# EasyEDA Pro project ProProject_Air001_2024-07-03.epro

# Schematic Schematic1
Create Date: 2024-04-21; Page Name: P1; Project Name: Air001; Schematic Name: Schematic1; Update Date: 2024-05-07; Company: 嘉立创EDA; Page Size: A4; Version: V1.0
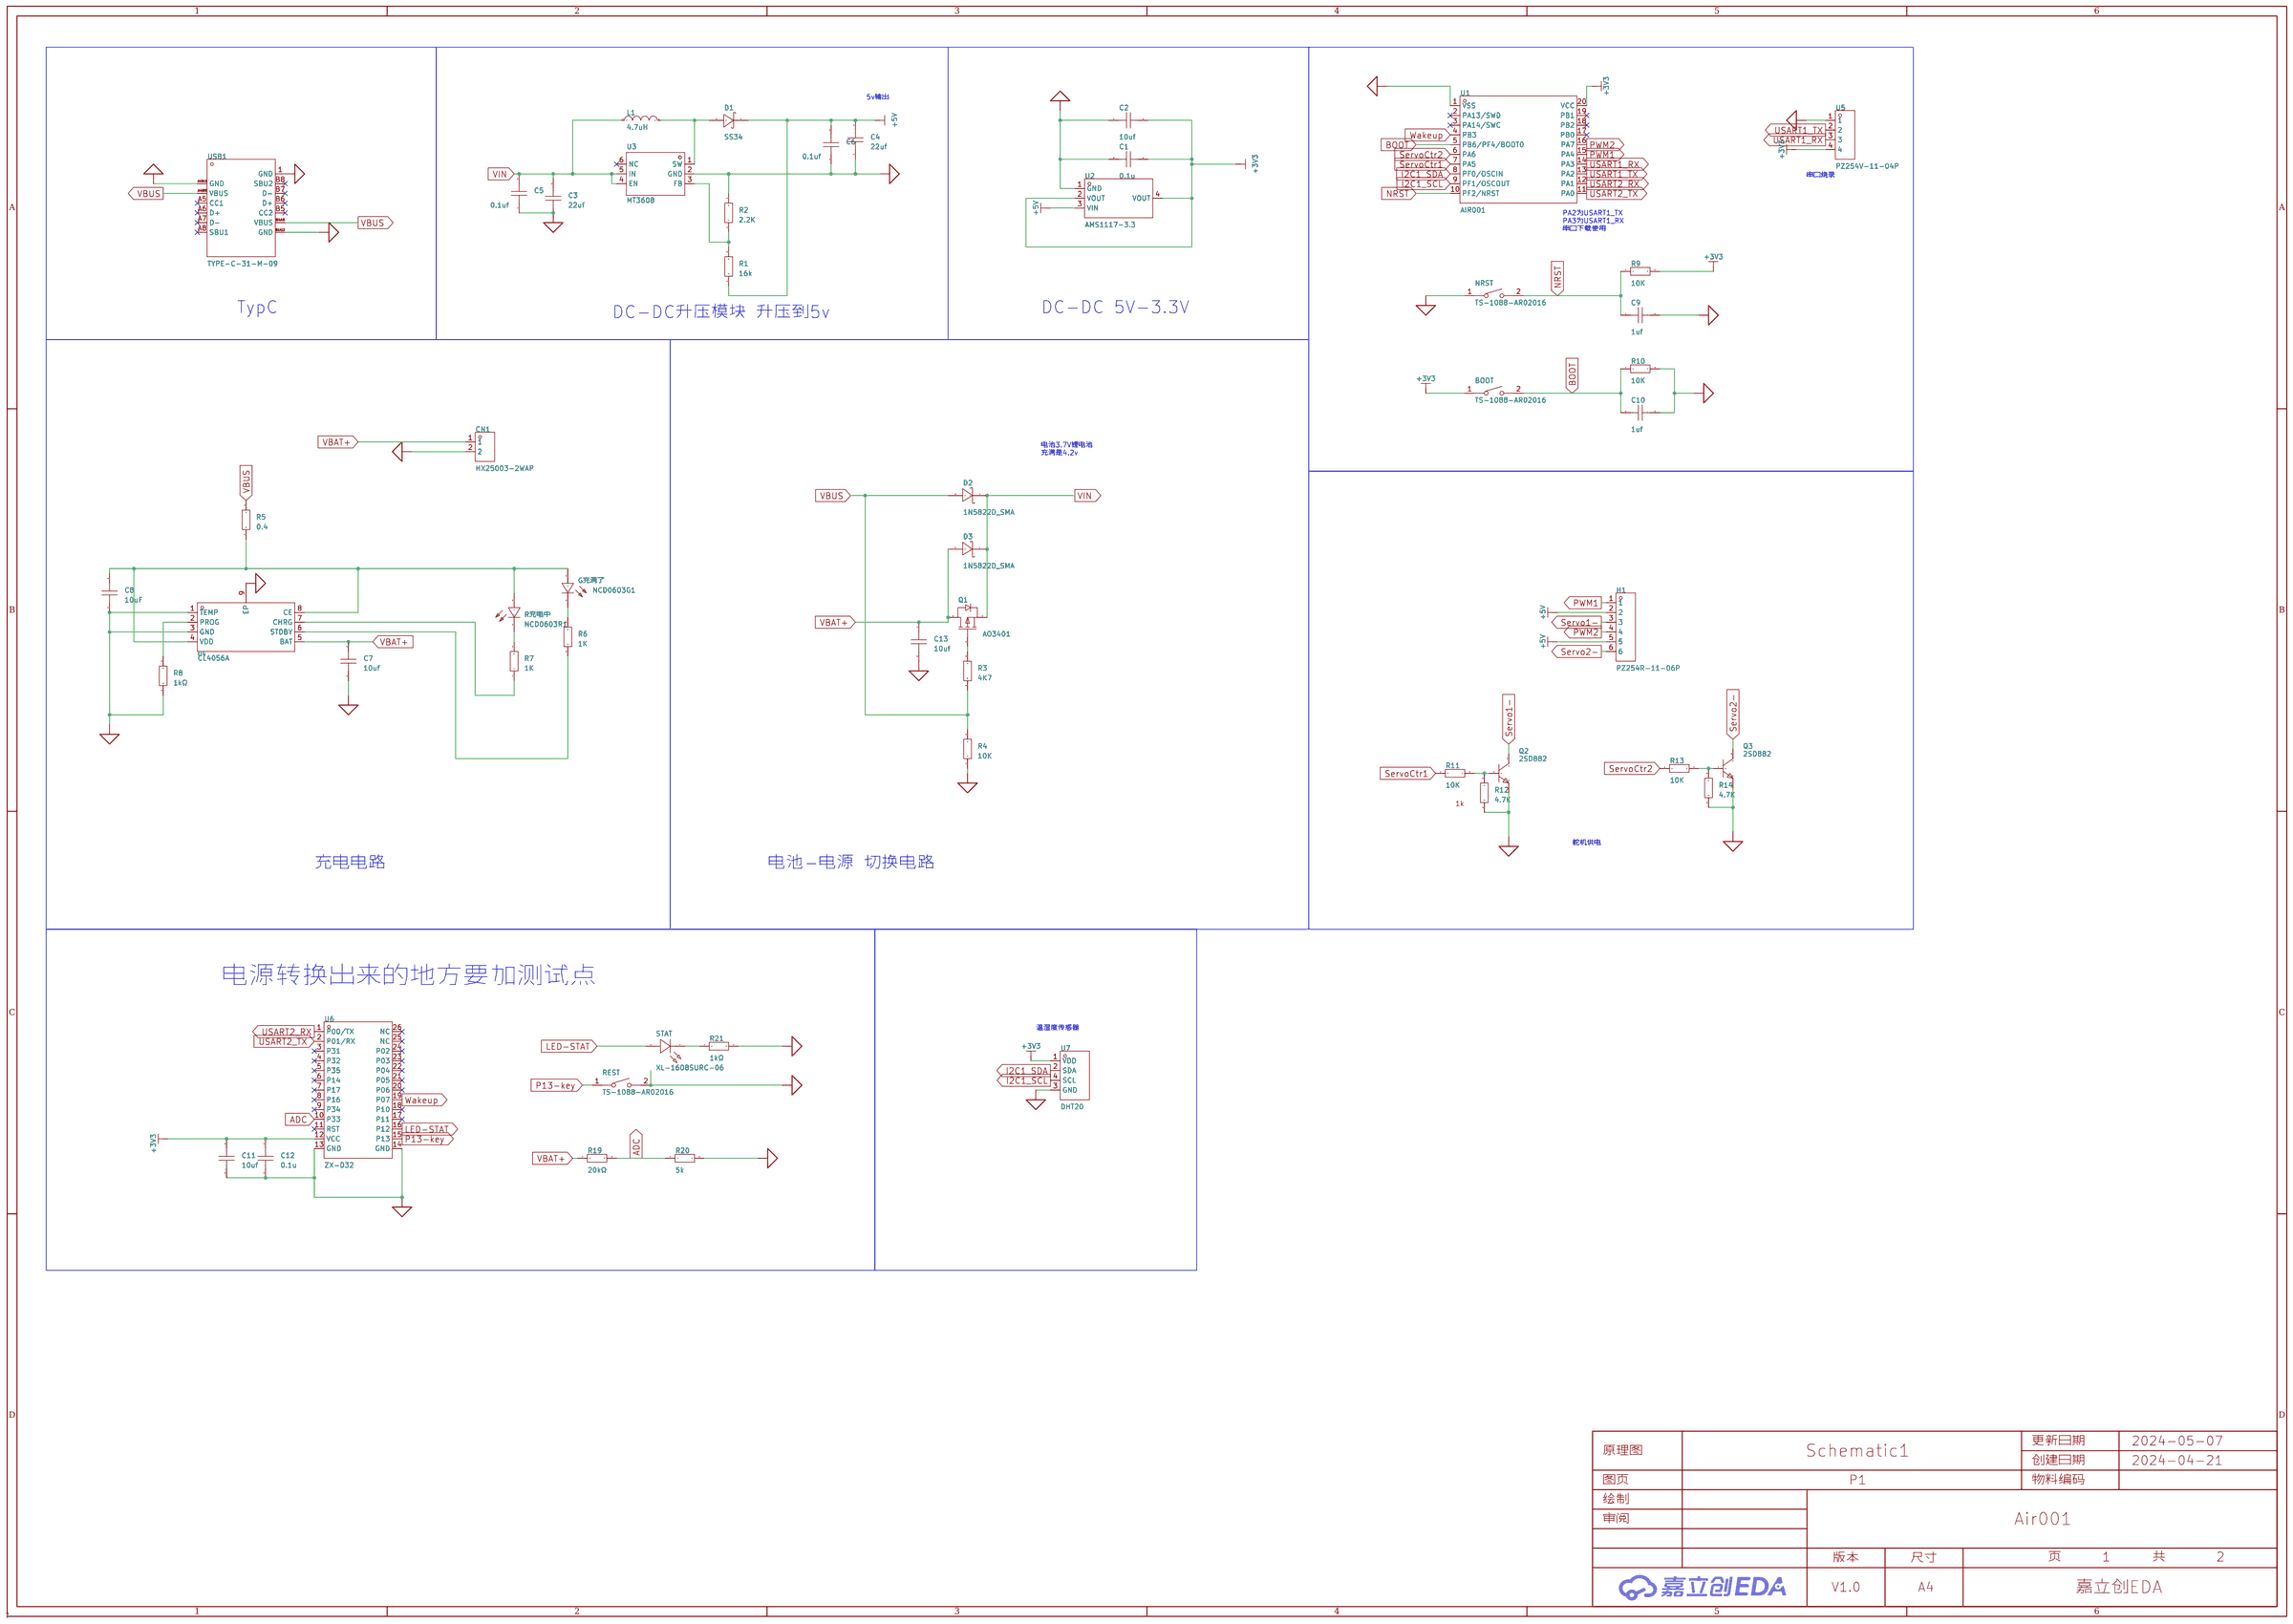
[diagram p0: schematic sheet]

## Parts
BOOT  TS-1088-AR02016  [SW-SMD_L3.9-W3.0-P4.45]
C1  0.1u  [C0603]
C2  10uf  [C0603]
C3  22uf  [C0603]
C4  22uf  [C0603]
C5  0.1uf  [C0603]
C6  0.1uf  [C0603]
C7  10uf  [C0603]
C8  10uF  [C0603]
C9  1uf  [C0603]
C10  1uf  [C0603]
C11  10uf  [C0603]
C12  0.1u  [C0603]
C13  10uf  [C0603]
CN1  HX25003-2WAP  [CONN-TH_2P-P2.50_HX25003-2WAP]
D1  SS34  [SMA_L4.3-W2.6-LS5.2-RD]
D2  1N5822D_SMA  [SMA_L4.3-W2.6-LS5.2-RD]
D3  1N5822D_SMA  [SMA_L4.3-W2.6-LS5.2-RD]
G充满了  NCD0603G1  [LED0603-RD]
H1  PZ254R-11-06P  [HDR-TH_6P-P2.54-H-M-W10.4]
L1  4.7uH  [IND-SMD_L11.5-W10.0_SMMS1040]
NRST  TS-1088-AR02016  [SW-SMD_L3.9-W3.0-P4.45]
Q1  AO3401  [SOT-23-3_L2.9-W1.6-P1.90-LS2.8-BR]
Q2  2SD882  [SOT-89-3_L4.5-W2.5-P1.50-LS4.1-BR]
Q3  2SD882  [SOT-89-3_L4.5-W2.5-P1.50-LS4.1-BR]
R1  16k  [C0805]
R2  2.2K  [R0805]
R3  4K7  [R0603]
R4  10K  [R0603]
R5  0.4  [R0603]
R6  1K  [R0603]
R7  1K  [R0603]
R8  1kΩ  [R0603]
R9  10K  [R0603]
R10  10K  [R0603]
R11  10K  [R0603]
R12  4.7K  [R0603]
R13  10K  [R0603]
R14  4.7K  [R0603]
R19  20kΩ  [R0603]
R20  5k  [R0603]
R21  1kΩ  [R0603]
REST  TS-1088-AR02016  [SW-SMD_L3.9-W3.0-P4.45]
R充电中  NCD0603R1  [LED0603-RD_RED]
STAT  XL-1608SURC-06  [LED0603-RD_RED]
U1  AIR001  [TSSOP-20_L6.5-W4.4-P0.65-LS6.4-BL]
U2  AMS1117-3.3  [SOT-223-3_L6.5-W3.4-P2.30-LS7.0-BR]
U3  MT3608  [SOT-23-6_L2.9-W1.6-P0.95-LS2.8-BL]
U4  CL4056A  [ESOP-8_L4.9-W3.9-P1.27-LS6.0-BL-EP]
U5  PZ254V-11-04P  [HDR-TH_4P-P2.54-V-M]
U6  ZX-D32  [WIFIM-SMD_26P-L26.7-W13.0-P1.50]
U7  DHT20  [SENSOR-TH_DHT20]
USB1  TYPE-C-31-M-09  [USB-C-SMD_TYPE-C-31-M-09]

## Library data of the parts
BOOT NRST REST = TS-1088-AR02016: 电路结构:单刀单掷;按钮形状:圆形按钮;作用力:160gf;安装方式:立贴;开关长度:4mm;开关宽度:3mm;开关高度:2mm;带支架:不带;触点电流:50mA;额定电压(DC):12V;绝缘电阻:100MΩ;机械寿命:10万次;; LCSC Part Name: 4*3*2mm 立贴 轻触开关; Supplier Part: C720477; Manufacturer: XUNPU(讯普); Supplier Footprint: SMD; JLCPCB Part Class: 扩展库; Datasheet: https://atta.szlcsc.com/upload/public/pdf/source/20200810/C720475_60D09DD6C54279ADDB2DC25100F1CC11.pdf; Supplier: LCSC; Circuit: 单刀单掷; Actuator Style: 圆形按钮; Operating Force: 160gf; Mounting Style: 立贴; Switch Length: 4mm; Switch Width: 3mm; Switch Height: 2mm; Strike Gundam: 不带; Contact Current: 50mA; Voltage Rating (DC): 12V; Insulation Resistance: 100MΩ; Actuator/Cap Color: 黑色; Pin Style: SMD接片; Mechanical Life: 10万次; Operating Temperature: -30℃~+80℃
C1-C7 C9-C13 = CAP_0603: Supplier Footprint: 0603
C8 = CL10A106MA8NRNC: 容值:10uF;精度:±20%;额定电压:25V;材质(温度系数):X5R;; LCSC Part Name: 10uF ±20% 25V; Supplier Part: C96446; Manufacturer: SAMSUNG(三星); Supplier Footprint: 0603; JLCPCB Part Class: Basic Part; Datasheet: https://atta.szlcsc.com/upload/public/pdf/source/20160218/1457707763339.pdf; Supplier: LCSC; Tolerance: ±20%; Voltage Rated: 25V; Temperature Coefficient: X5R
CN1 = HX25003-2WAP: 插针结构:1x2P;间距:2.5mm;安装方式:弯插;参考系列:XH;总PIN数:2P;排数:1;每排PIN数:2;行距:-;额定电流:-;工作温度范围:-;; LCSC Part Name: 1x2P 间距:2.5mm 弯插 系列:XH; Supplier Part: C442326; Manufacturer: HX(红星); Supplier Footprint: 弯插,P=2.5mm; JLCPCB Part Class: 扩展库; Datasheet: https://atta.szlcsc.com/upload/public/pdf/source/20191028/C442341_CB026E8ECE589085FA4A025D9CD8B44B.pdf; Supplier: LCSC; Pins Structure: 1x2P; Pitch: 2.5mm; Mounting Style: 弯插; Reference Series: XH; Number of Pins: 2P; Number of Rows: 1; Number of PINs Per Row: 2
D1 = SS34_C8678: 二极管配置:独立式;正向压降(Vf):550mV@3A;直流反向耐压(Vr):40V;平均整流电流(Io):3A;; LCSC Part Name: 电压:40V 电流:3A; Supplier Part: C8678; Manufacturer: MDD; Supplier Footprint: SMA(DO-214AC); JLCPCB Part Class: 基础库; Datasheet: https://atta.szlcsc.com/upload/public/pdf/source/20230314/A80AE34493C69B89E2F4B1712F433538.pdf; Supplier: LCSC; Diode Configuration: 独立式; Forward Voltage (Vf@If): 550mV@3A; Reverse Voltage (Vr): 40V; Average Rectified Current (Io): 3A; Reverse Leakage Current (Ir): 500uA@40V
D2 D3 = 1N5822D_SMA: 二极管配置:独立式;正向压降(Vf):550mV@3A;直流反向耐压(Vr):40V;平均整流电流(Io):3A;; Supplier Part: C9900001949; Manufacturer: MDD; Supplier Footprint: SMA_L4.3-W2.6-LS5.2; JLCPCB Part Class: Extended Part; Datasheet: https://atta.szlcsc.com/upload/public/pdf/source/20230314/A80AE34493C69B89E2F4B1712F433538.pdf; Supplier: LCSC; Diode Configuration: 独立式; Forward Voltage (Vf@If): 550mV@3A; Reverse Voltage (Vr): 40V; Average Rectified Current (Io): 3A; Reverse Leakage Current (Ir): 500uA@40V
G充满了 = NCD0603G1: 发光颜色:翠绿色;正向电压(VF):2.6V~3.6V;功率:72mW;正向电流:10mA;主波长:515nm~530nm;透镜颜色:无色透明透镜;发光强度:330mcd~900mcd;发光角度:130°;工作温度:-30℃~+85℃;; Supplier Part: C84267; Manufacturer: 国星光电; Supplier Footprint: 0603; JLCPCB Part Class: 扩展库; Datasheet: https://atta.szlcsc.com/upload/public/pdf/source/20200820/C84267_04BA7703640BAC111D09F5EFB971FBF3.pdf; Supplier: LCSC; Emitted Color: 翠绿色; Forward Voltage (VF): 2.6V~3.6V; Power Dissipation: 72mW; Forward Current: 10mA; Dominant Wavelength: 515nm~530nm; Lens Color: 无色透明透镜; Luminous Intensity: 330mcd~900mcd; Viewing Angle: 130°; Operating Temperature: -30℃~+85℃
H1 = PZ254R-11-06P: 插针结构:1x6P;间距:2.54mm;行距:-;圆针/方针:方针;安装类型:弯插;排数:单排;总PIN位数:6P;额定电流:-;额定电压:-;配合针长度:6mm;塑高:2.5mm;触头材质:黄铜;触头镀层:-;工作温度范围:-40℃~+105℃;颜色:黑色;; LCSC Part Name: 间距:2.54mm 1x6P 弯插 方针; Supplier Part: C492414; Manufacturer: XFCN(兴飞); Supplier Footprint: 弯插,P=2.54mm; JLCPCB Part Class: 扩展库; Datasheet: https://atta.szlcsc.com/upload/public/pdf/source/20200309/C492414_188252315A8FC19F8382BF484DD4F4B8.pdf; Supplier: LCSC; Pin Structure: 1x6P; Pitch: 2.54mm; Circluar Pins/Square Pins: 方针; Mounting Type: 弯插; Number of Rows: 单排; Number of Pins: 6P; Length of Mating Pin: 6mm; Insulation Height: 2.5mm; Contact Material: 黄铜; Operating Temperature Range: -40℃~+105℃; Color: 黑色
L1 = YSPI1050-4R7M: 电感值:4.7uH;精度:±20%;额定电流:8A;; LCSC Part Name: 4.7uH ±20%; Supplier Part: C497895; Manufacturer: YJYCOIN(益嘉源); Supplier Footprint: SMD,10x10.1mm; JLCPCB Part Class: Extended Part; Datasheet: https://atta.szlcsc.com/upload/public/pdf/source/20200317/C497892_513B7AAEAA9324EEBE20C95E8E203C0E.pdf; Supplier: LCSC; Tolerance: ±20%; Rated Current: 8A; DC Resistance (DCR): 13.8mΩ
Q1 = AO3401_C688915: 类型:1个P沟道;漏源电压(Vdss):30V;连续漏极电流(Id):4.2A;功率(Pd):1.2W;导通电阻(RDS(on)@Vgs,Id):50mΩ@10V,4.2A;阈值电压(Vgs(th)@Id):1V@250uA;; LCSC Part Name: 1个P沟道 耐压:30V 电流:4.2A; Supplier Part: C688915; Manufacturer: LGE(鲁光); Supplier Footprint: SOT-23; JLCPCB Part Class: 扩展库; Datasheet: https://atta.szlcsc.com/upload/public/pdf/source/20200622/C688915_14CA049379670312E9F9920C23D236FF.pdf; Supplier: LCSC; Type: 1个P沟道; Drain Source Voltage (Vdss): 30V; Continuous Drain Current (Id): 4.2A; Power Dissipation (Pd): 1.2W; Drain Source On Resistance (RDS(on)@Vgs,Id): 50mΩ@10V,4.2A; Gate Threshold Voltage (Vgs(th)@Id): 1V@250uA; Total Gate Charge (Qg@Vgs): 9.5nC@4.5V; Input Capacitance (Ciss@Vds): 950pF@15V; Reverse Transfer Capacitance (Crss@Vds): 75pF@15V
Q2 Q3 = 2SD882_C842818: 晶体管类型:NPN;集电极电流(Ic):3A;集射极击穿电压(Vceo):30V;功率(Pd):500mW;; LCSC Part Name: 耐压:30V 电流:3A NPN; Supplier Part: C842818; Manufacturer: FUXINSEMI(富芯森美); Supplier Footprint: SOT-89-3; JLCPCB Part Class: 扩展库; Datasheet: https://atta.szlcsc.com/upload/public/pdf/source/20200930/C842818_75E6D807A97B150B9507AB7B86B43F2A.pdf; Supplier: LCSC; Transistor Type: NPN; Collector Current (Ic): 3A; Collector-Emitter Breakdown Voltage (Vceo): 30V; Power Dissipation (Pd): 500mW; Transition Frequency (fT): 50MHz; Collector Cut-Off Current (Icbo): 1uA; Collector-Emitter Saturation Voltage (VCE(sat)@Ic,Ib): 500mV@2A,200mA; Operating Temperature: -55℃~+150℃@(Tj)
R1-R7 R9-R14 = Res_0603: Supplier Footprint: 0603
R8 R21 = RC0603FR-071KL: 电阻类型:厚膜电阻;阻值:1kΩ;精度:±1%;功率:100mW;最大工作电压:75V;温度系数:±100ppm/℃;; LCSC Part Name: 厚膜电阻 1kΩ ±1% 100mW; Supplier Part: C22548; Manufacturer: YAGEO(国巨); Supplier Footprint: 0603; JLCPCB Part Class: Extended Part; Datasheet: https://atta.szlcsc.com/upload/public/pdf/source/20180316/70C0E2BDAE7FCC62C531A5A58D202EE1.pdf; Supplier: LCSC; Type: 厚膜电阻; Tolerance: ±1%; Power(Watts): 100mW; Overload Voltage (Max): 75V; Temperature Coefficient: ±100ppm/℃; Operating Temperature Range: -55℃~+155℃
R19 = 0603WAF1002T5E: 电阻类型:厚膜电阻;阻值:10kΩ;精度:±1%;功率:100mW;最大工作电压:75V;温度系数:±100ppm/℃;; LCSC Part Name: 厚膜电阻 10kΩ ±1% 100mW; Supplier Part: C25804; Manufacturer: UNI-ROYAL(厚声); Supplier Footprint: 0603; JLCPCB Part Class: Basic Part; Datasheet: https://atta.szlcsc.com/upload/public/pdf/source/20200306/C422600_1E6D84923E4A46A82E41ADD87F860B5C.pdf; Supplier: LCSC; Type: 厚膜电阻; Tolerance: ±1%; Power(Watts): 100mW; Overload Voltage (Max): 75V; Temperature Coefficient: ±100ppm/℃; Operating Temperature Range: -55℃~+155℃
R20 = 0603WAF2701T5E: 电阻类型:厚膜电阻;阻值:2.7kΩ;精度:±1%;功率:100mW;最大工作电压:75V;温度系数:±100ppm/℃;; LCSC Part Name: 2.7kΩ ±1% 100mW 厚膜电阻; Supplier Part: C13167; Manufacturer: UNI-ROYAL(厚声); Supplier Footprint: 0603; JLCPCB Part Class: Basic Part; Datasheet: https://atta.szlcsc.com/upload/public/pdf/source/20200306/C422600_1E6D84923E4A46A82E41ADD87F860B5C.pdf; Supplier: LCSC; Type: 厚膜电阻; Tolerance: ±1%; Power(Watts): 100mW; Overload Voltage (Max): 75V; Temperature Coefficient: ±100ppm/℃; Operating Temperature Range: -55℃~+155℃
R充电中 = NCD0603R1_C84263: 灯头类型:-;发光颜色:红色;正向电压(VF):1.6V~2.6V;功率:65mW;正向电流:20mA;主波长:615nm~630nm;二极管配置:独立二极管;透镜颜色:无色透明透镜;色温:-;发光强度:80mcd~220mcd;发光角度:130°;载带方式:-;工作温度:-30℃~+85℃;; Supplier Part: C84263; Manufacturer: 国星光电; Supplier Footprint: 0603; JLCPCB Part Class: 扩展库; Datasheet: https://atta.szlcsc.com/upload/public/pdf/source/20200820/C84263_DABC6A75E58F576973B407FDBA283D60.pdf; Supplier: LCSC; Emitted Color: 红色; Forward Voltage (VF): 1.6V~2.6V; Power Dissipation: 65mW; Forward Current: 20mA; Dominant Wavelength: 615nm~630nm; Diode Configuration: 独立二极管; Lens Color: 无色透明透镜; Luminous Intensity: 80mcd~220mcd; Viewing Angle: 130°; Operating Temperature: -30℃~+85℃
STAT = XL-1608SURC-06: 发光颜色:红色;功率:55mW;正向电流:25mA;主波长:617nm~621nm;透镜颜色:无色透明透镜;色温:-;发光角度:120°;载带方式:正贴;工作温度:-30℃~+85℃;; Supplier Part: C965799; Manufacturer: XINGLIGHT(成兴光); Supplier Footprint: 0603; JLCPCB Part Class: 扩展库; Datasheet: https://atta.szlcsc.com/upload/public/pdf/source/20221102/D860AFDD1CDB02C5A8064103A32707E2.pdf; Supplier: LCSC; Emitted Color: 红色; Power Dissipation: 55mW; Forward Current: 25mA; Dominant Wavelength: 617nm~621nm; Peak Wavelength: 623nm; Lens Color: 无色透明透镜; Viewing Angle: 120°; Mounting Sytle: 正贴; Operating Temperature: -30℃~+85℃
U1 = AIR001: Supplier Part: C7461672; Supplier Footprint: TSSOP-20; JLCPCB Part Class: 扩展库; Supplier: LCSC
U2 = AMS1117-3.3_C6186: 输出类型:固定;最大输入电压:-;输出电压:3.3V;最大输出电流:1A;电源纹波抑制比(PSRR):72dB@(120Hz);输出极性:正极;; LCSC Part Name: 输出3.3V 1A; Supplier Part: C6186; Manufacturer: AMS; Supplier Footprint: SOT-223-3; JLCPCB Part Class: 基础库; Datasheet: https://atta.szlcsc.com/upload/public/pdf/source/20180727/C6186_7A095716F0823C02F1997A905E26C086.pdf; Supplier: LCSC; Output Type: 固定; Output Voltage: 3.3V; MAX Output Current: 1A; Power Supply Rejection Ratio (PSRR): 72dB@(120Hz); Dropout Voltage: 1.3V@(800mA); Output Polarity: 正极; Number of Outputs: 1
U3 = MT3608: 功能类型:升压型;输入电压:2V~24V;输出电压:28V;输出电流(最大值):-;; Supplier Part: C84817; Manufacturer: 西安航天民芯; Supplier Footprint: SOT-23-6; JLCPCB Part Class: 扩展库; Datasheet: https://atta.szlcsc.com/upload/public/pdf/source/20161110/1478743351706.pdf; Supplier: LCSC; Function: 升压型; Input Voltage: 2V~24V; Output Voltage: 28V; Switching Frequency: 1.2MHz; Number of Outputs: 1; Topology: 升压式; Switch tube (built-in/external): 内置
U4 = CL4056A: Supplier Part: C181916; Manufacturer: CHIPLINK(芯联); Supplier Footprint: ESOP-8; JLCPCB Part Class: 扩展库; Datasheet: https://atta.szlcsc.com/upload/public/pdf/source/20180301/C181916_15198944900991384040.pdf; Supplier: LCSC
U5 = PZ254V-11-04P: 插针结构:1x4P;间距:2.54mm;行距:-;圆针/方针:方针;安装类型:直插;排数:单排;总PIN位数:4P;额定电流:3A;额定电压:250V;配合针长度:6mm;塑高:2.5mm;端接针长度:3mm;触头材质:-;工作温度范围:-40℃~+105℃;颜色:黑色;; LCSC Part Name: 间距:2.54mm 1x4P 直插 方针; Supplier Part: C2691448; Manufacturer: XFCN(兴飞); Supplier Footprint: 插件,P=2.54mm; JLCPCB Part Class: Extended Part; Datasheet: https://atta.szlcsc.com/upload/public/pdf/source/20200309/C492403_F9F19131791D08044AD4F84F8E751A34.pdf; Supplier: LCSC; Pin Structure: 1x4P; Pitch: 2.54mm; Circluar Pins/Square Pins: 方针; Mounting Type: 直插; Number of Rows: 单排; Number of Pins: 4P; Current Rating (Max): 3A; Voltage Rating (Max): 250V; Length of Mating Pin: 6mm; Insulation Height: 2.5mm; Length of End Connection Pin: 3mm; Operating Temperature Range: -40℃~+105℃; Color: 黑色
U6 = ZX-D32_1: Supplier Part: F; Supplier Footprint: QFN; JLCPCB Part Class: 扩展库; Supplier: LCSC
U7 = DHT20: LCSC Part Name: 温湿度传感器模块; Supplier Part: C3012627; Manufacturer: 广州奥松; Supplier Footprint: SIP-4; JLCPCB Part Class: 扩展库; Datasheet: https://atta.szlcsc.com/upload/public/pdf/source/20220512/BB794F5DBF3D5EF255732E5D5E8CA7C2.pdf; Supplier: LCSC
USB1 = TYPE-C-31-M-09: 连接器类型:Type-C;标准:-;公母:母;端口数量:1;触点数量:16P;安装方式:卧贴;额定电流 - 电源:-;工作温度范围:-40℃~+80℃;; LCSC Part Name: Type-C 母 卧贴; Supplier Part: C2689967; Manufacturer: 韩国韩荣; Supplier Footprint: SMD; JLCPCB Part Class: 扩展库; Datasheet: https://atta.szlcsc.com/upload/public/pdf/source/20210810/4FB1FF27D732B53405BB8B0F3A718A10.pdf; Supplier: LCSC; Connector Type: Type-C; Gender: 母; Number of Ports: 1; Number of Contacts: 16P; Mounting Style: 卧贴; Operating Temperature Range: -40℃~+80℃

## Nets
+3V3: BOOT.1 C1.1 C2.2 C11.2 C12.1 R9.2 U1.20(VCC) U2.2(VOUT) U2.4(VOUT) U5.4 U6.12(VCC) U7.1(VDD)
+5V: C4.2 C6.2 D1.1(K) H1.2 H1.5 R1.1 U2.3(VIN)
AGND: C1.2 C2.1 C3.1 C4.1 C5.1 C6.1 C7.2 C8.1 C9.2 C10.2 C11.1 C12.2 C13.2 CN1.2 NRST.1 Q2.3(E) Q3.3(E) R2.2 R4.1 R8.1 R10.2 R12.1 R14.1 R20.2 R21.2 REST.2 U1.1(VSS) U2.1(GND) U3.2(GND) U4.1(TEMP) U4.3(GND) U4.9(EP) U5.1 U6.13(GND) U6.14(GND) U7.3(GND) USB1.1(GND) USB1.A1B12(GND) USB1.B1A12(GND)
VBAT+: C7.1 C13.1 CN1.1 D3.2(A) Q1.3(D) R19.1 U4.5(BAT)
VBUS: D2.2(A) R3.1 R4.2 R5.2 USB1.A4B9(VBUS) USB1.B4A9(VBUS)
VIN: C3.2 C5.2 D2.1(K) D3.1(K) L1.1 Q1.2(S) U3.4(EN) U3.5(IN)
ADC: R19.2 R20.1 U6.10(P33)
BOOT: BOOT.2 C10.1 R10.1 U1.5(PB6/PF4/BOOT0)
I2C1_SCL: U1.9(PF1/OSCOUT) U7.4(SCL)
I2C1_SDA: U1.8(PF0/OSCIN) U7.2(SDA)
LED-STAT: STAT.2(A) U6.16(P12)
NRST: C9.1 NRST.2 R9.1 U1.10(PF2/NRST)
P13-key: REST.1 U6.15(P13)
PWM1: H1.1 U1.15(PA4)
PWM2: H1.4 U1.16(PA7)
Servo1-: H1.3 Q2.2(C)
Servo2-: H1.6 Q3.2(C)
ServoCtr1: R11.1 U1.7(PA5)
ServoCtr2: R13.1 U1.6(PA6)
USART1_RX: U1.14(PA3) U5.3
USART1_TX: U1.13(PA2) U5.2
USART2_RX: U1.12(PA1) U6.1(P00/TX)
USART2_TX: U1.11(PA0) U6.2(P01/RX)
Wakeup: U1.4(PB3) U6.19(P07)
$1N1635: D1.2(A) L1.2 U3.1(SW)
$1N1808: R1.2 R2.1 U3.3(FB)
$1N2553: Q1.1(G) R3.2
$1N3521: G充满了.1(K) R6.2
$1N3547: R7.2 R充电中.1(K)
$1N3574: R6.1 U4.6(STDBY)
$1N3588: R7.1 U4.7(CHRG)
$1N3600: C8.2 G充满了.2(A) R5.1 R充电中.2(A) U4.4(VDD) U4.8(CE)
$1N3631: R8.2 U4.2(PROG)
$1N5712: Q2.1(B) R11.2 R12.2
$1N5900: Q3.1(B) R13.2 R14.2
$1N6798: R21.1 STAT.1(K)

Not connected (* = marked no-connect by the designer): U1 2(PA13/SWD)* 3(PA14/SWC)* 17(PB0)* 18(PB2)* 19(PB1)*; U3 6(NC)*; U6 3(P31)* 4(P32)* 5(P35)* 6(P14)* 7(P17)* 8(P16)* 9(P34)* 11(RST)* 17(P11)* 18(P10)* 20(P06)* 21(P05)* 22(P04)* 23(P03)* 24(P02)* 25(NC)* 26(NC)*; USB1 A5(CC1)* A6(D+)* A7(D-)* A8(SBU1)* B5(CC2)* B6(D+)* B7(D-)* B8(SBU2)*

## Notes on the sheet
- 5v输出
- 串口烧录
- PA2为USART1_TX
  PA3为USART1_RX
  串口下载使用
- TypC
- DC-DC 5V-3.3V
- DC-DC升压模块 升压到5v
- 电池3.7V锂电池
  充满是4.2v
- 1k
- 舵机供电
- 充电电路
- 电池-电源 切换电路
- 电源转换出来的地方要加测试点
- 温湿度传感器

# Board PCB1
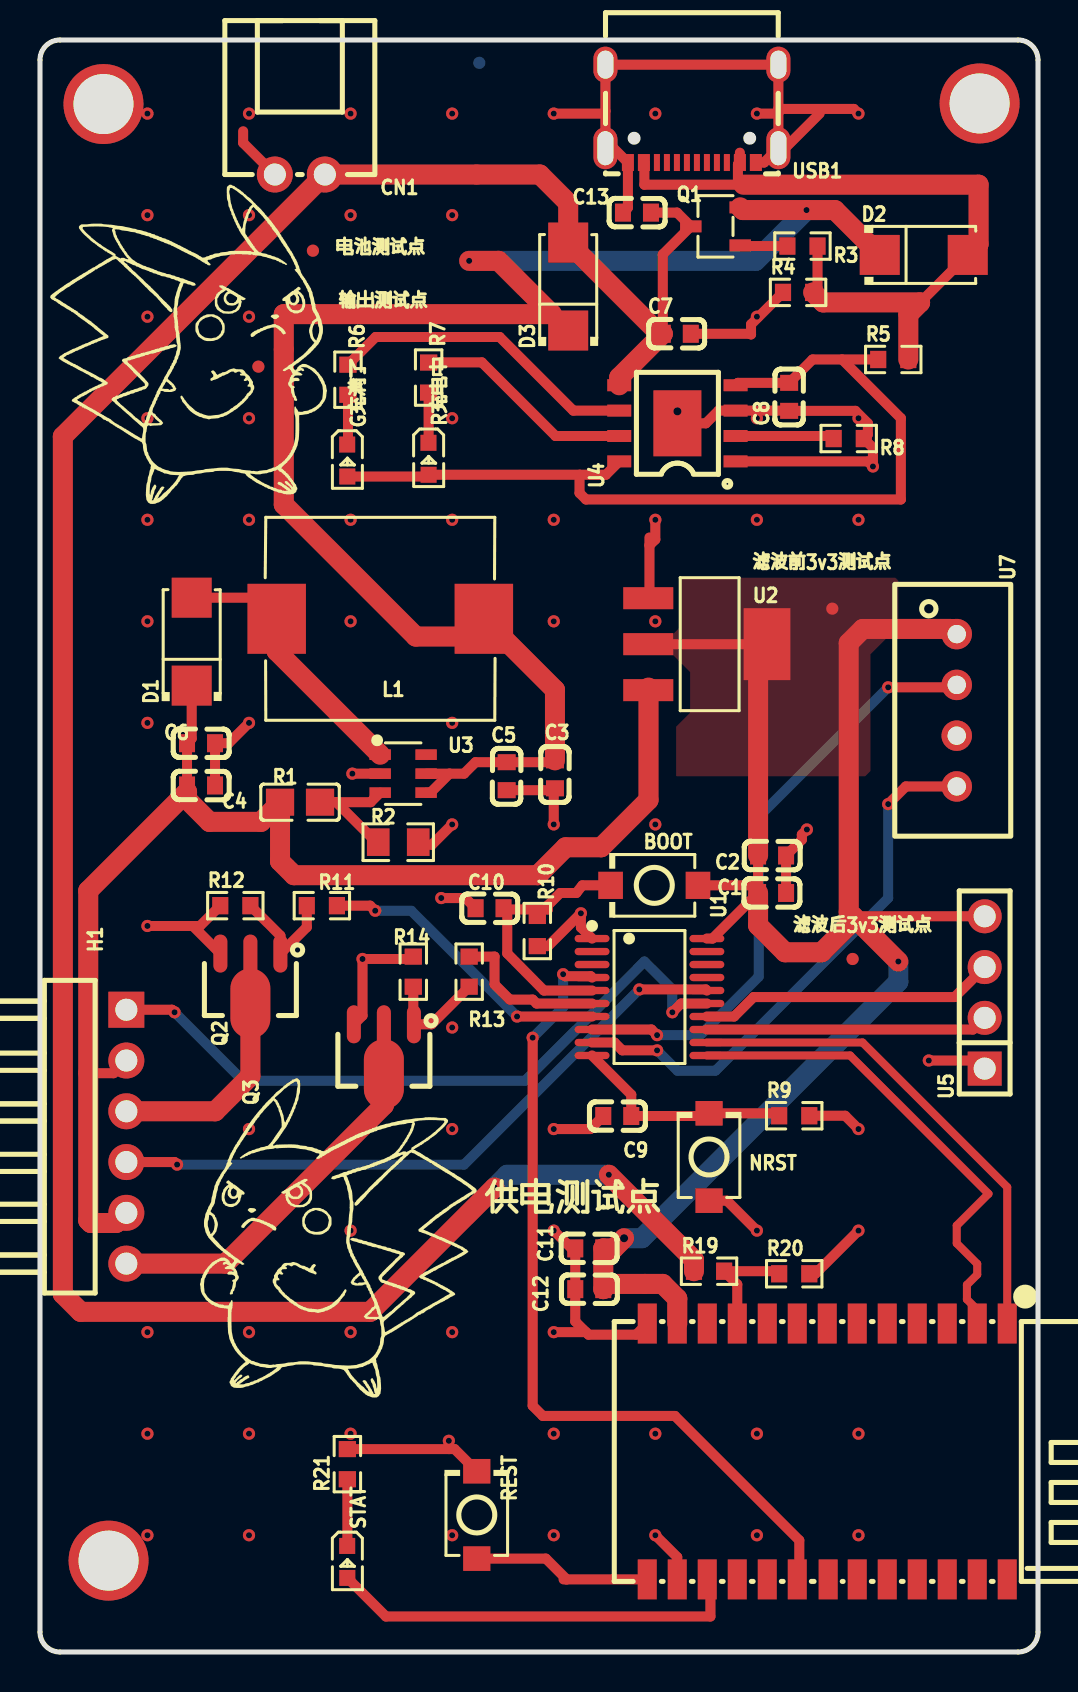
[diagram p1: board, top side]
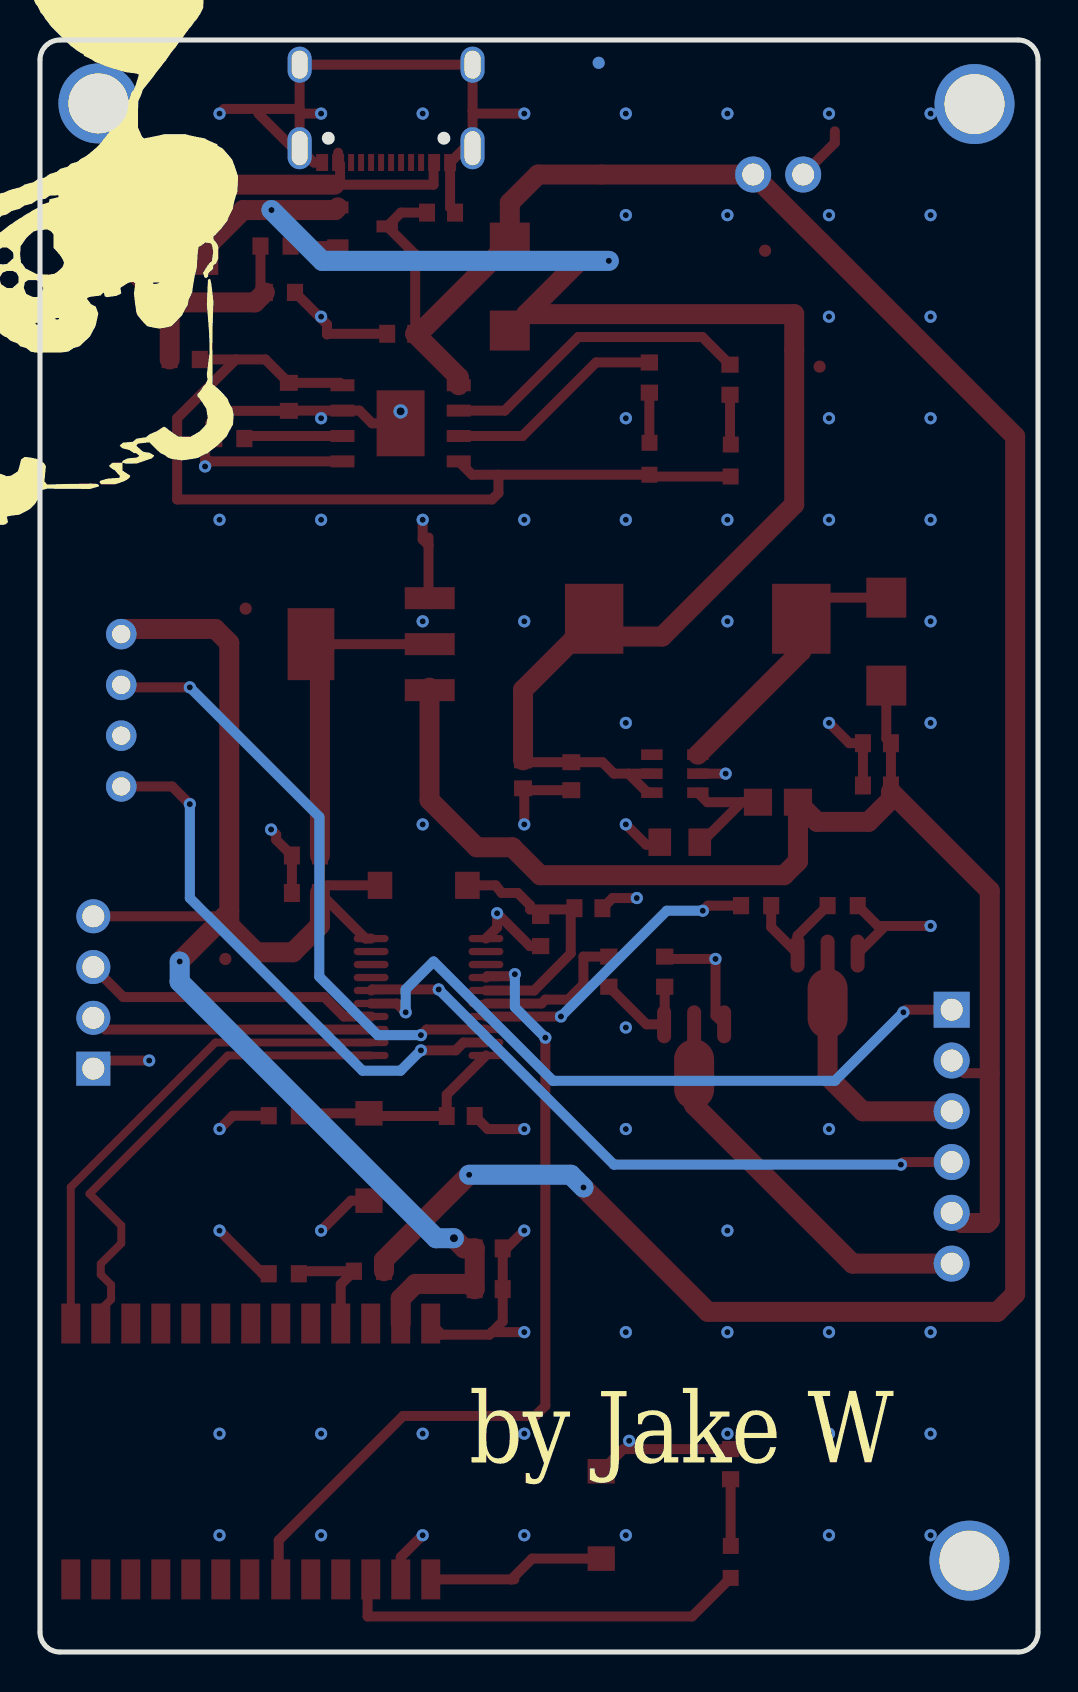
[diagram p2: board, bottom side, seen from below]

Outline 49.91 x 80.65 mm; copper layers: Top Layer, Bottom Layer. Coordinates in mm from the lower left corner of the outline.
Outline path: 0,79.65 0,1 arc(0.29,0.29) 1,0 48.91,0 arc(49.62,0.29) 49.91,1 49.91,79.65 arc(49.62,80.35) 48.91,80.65 1,80.65 arc(0.29,80.35) 0,79.65
Stack: Top Layer 0.035mm / Dielectric1 1.51mm FR4 er 4.5 / Bottom Layer 0.035mm

## Design rules (mm)
net USART2_RX: DP1
net USART2_TX: DP1
template: JLCPCB Capability(Two Layers Board)
spacing copperThickness1oz (default): track to track 0.102, other pairs 0.152 to 0.3
spacing copperThickness2oz: track to track 0.203, other pairs 0.152 to 0.3
track width copperThickness1oz (default): min 0.127, default 0.254, max 2.54
track width copperThickness2oz: min 0.203, default 0.254, max 2.54
differential pair differentialPair (default): width min 0.127, default 0.254, max 2.54; gap min 0.152, default 0.152
via viaSize (default): diameter min 0.5, default 0.61, max 10; hole min 0.3, default 0.305, max 6.3

## Placement (name value [footprint] x y rotation side)
BOOT  TS-1088-AR02016  [SW-SMD_L3.9-W3.0-P4.45]  30.72 38.35 180 top
C1  0.1u  [C0603]  36.61 37.97 0 top
C2  10uf  [C0603]  36.61 39.85 180 top
C3  22uf  [C0603]  25.75 43.91 90 top
C4  22uf  [C0603]  8.05 43.35 180 top
C5  0.1uf  [C0603]  23.34 43.82 90 top
C6  0.1uf  [C0603]  8.05 45.47 180 top
C7  10uf  [C0603]  31.85 65.95 0 top
C8  10uF  [C0603]  37.46 62.79 90 top
C9  1uf  [C0603]  28.87 26.81 180 top
C10  1uf  [C0603]  22.48 37.21 180 top
C11  10uf  [C0603]  27.47 20.19 0 top
C12  0.1u  [C0603]  27.47 18.15 180 top
C13  10uf  [C0603]  29.85 72.01 180 top
CN1  HX25003-2WAP  [CONN-TH_2P-P2.50_HX25003-2WAP]  12.99 73.91 180 top
D1  SS34  [SMA_L4.3-W2.6-LS5.2-RD]  7.59 50.55 90 top
D2  1N5822D_SMA  [SMA_L4.3-W2.6-LS5.2-RD]  44.2 69.89 0 top
D3  1N5822D_SMA  [SMA_L4.3-W2.6-LS5.2-RD]  26.42 68.31 90 top
G充满了  NCD0603G1  [LED0603-RD]  15.37 59.61 270 top
H1  PZ254R-11-06P  [HDR-TH_6P-P2.54-H-M-W10.4]  4.32 25.78 270 top
L1  4.7uH  [IND-SMD_L11.5-W10.0_SMMS1040]  17.02 51.69 180 top
NOREF  -  [Pad_e2450]  3.17 77.44 0 top
NOREF#2  -  [Pad_e2380]  10.92 64.3 0 top
NOREF#3  -  [Pad_e2453]  46.99 77.47 0 top
NOREF#4  -  [Pad_e2384]  39.62 52.2 0 top
NOREF#5  -  [Pad_e2454]  3.43 4.57 0 top
NOREF#6  -  [Pad_e2445]  21.97 79.5 0 top
NOREF#7  -  [Pad_e2442]  40.64 34.67 0 top
NOREF#8  -  [Pad_e2397]  13.65 70.1 0 top
NOREF#9  -  [Pad_e2429]  30.25 18.42 0 top
NRST  TS-1088-AR02016  [SW-SMD_L3.9-W3.0-P4.45]  33.46 24.77 90 top
Q1  AO3401  [SOT-23-3_L2.9-W1.6-P1.90-LS2.8-BR]  33.78 71.32 0 top
Q2  2SD882  [SOT-89-3_L4.5-W2.5-P1.50-LS4.1-BR]  10.52 33.69 90 top
Q3  2SD882  [SOT-89-3_L4.5-W2.5-P1.50-LS4.1-BR]  17.2 30.15 90 top
R1  16k  [C0805]  13 42.51 0 top
R2  2.2K  [R0805]  17.92 40.51 0 top
R3  4K7  [R0603]  38.13 70.33 180 top
R4  10K  [R0603]  37.91 68.02 0 top
R5  0.4  [R0603]  42.67 64.66 0 top
R6  1K  [R0603]  15.4 63.65 270 top
R7  1K  [R0603]  19.44 63.76 270 top
R8  1kΩ  [R0603]  40.44 60.71 180 top
R9  10K  [R0603]  37.72 26.83 0 top
R10  10K  [R0603]  24.87 36.07 270 top
R11  10K  [R0603]  14.1 37.34 180 top
R12  4.7K  [R0603]  9.77 37.34 0 top
R13  10K  [R0603]  21.46 34.04 270 top
R14  4.7K  [R0603]  18.67 34.04 270 top
R19  20kΩ  [R0603]  33.46 19.05 0 top
R20  5k  [R0603]  37.72 18.92 0 top
R21  1kΩ  [R0603]  15.37 9.4 90 top
REST  TS-1088-AR02016  [SW-SMD_L3.9-W3.0-P4.45]  21.84 6.86 90 top
R充电中  NCD0603R1  [LED0603-RD_RED]  19.43 59.69 270 top
STAT  XL-1608SURC-06  [LED0603-RD_RED]  15.37 4.51 270 top
U1  AIR001  [TSSOP-20_L6.5-W4.4-P0.65-LS6.4-BL]  30.48 32.77 270 top
U2  AMS1117-3.3  [SOT-223-3_L6.5-W3.4-P2.30-LS7.0-BR]  33.39 50.42 180 top
U3  MT3608  [SOT-23-6_L2.9-W1.6-P0.95-LS2.8-BL]  18.16 43.94 270 top
U4  CL4056A  [ESOP-8_L4.9-W3.9-P1.27-LS6.0-BL-EP]  31.88 61.47 90 top
U5  PZ254V-11-04P  [HDR-TH_4P-P2.54-V-M]  47.24 33 90 top
U6  ZX-D32  [WIFIM-SMD_26P-L26.7-W13.0-P1.50]  39.37 10.03 270 top
U7  DHT20  [SENSOR-TH_DHT20]  45.85 47.11 270 top
USB1  TYPE-C-31-M-09  [USB-C-SMD_TYPE-C-31-M-09]  32.6 76.96 180 top

## Footprints (pads in the part's own frame, mm; a bottom-side part is the same pattern mirrored in y, then rotated)
C0603
  rect 0.8x0.9 smd: 1(-0.7,0) 2(0.7,0)
C0805
  rect 1.41x1.35 smd: 1(-1,0) 2(1,0)
CONN-TH_2P-P2.50_HX25003-2WAP
  round 1.8 hole 1.1: 1(-1.25,0) 2(1.25,0)
ESOP-8_L4.9-W3.9-P1.27-LS6.0-BL-EP
  rect 0.6x1.2 smd: 1(-1.905,-2.909) 2(-0.635,-2.909) 3(0.635,-2.909) 4(1.905,-2.909) 5(1.905,2.909) 6(0.635,2.909) 7(-0.635,2.909) 8(-1.905,2.909)
  rect 3.3x2.4 smd: 9(0,0)
HDR-TH_4P-P2.54-V-M
  rect 1.7x1.7 hole 1.1: 1(-3.81,0)
  round 1.7 hole 1.1: 2(-1.27,0) 3(1.27,0) 4(3.81,0)
HDR-TH_6P-P2.54-H-M-W10.4
  rect 1.8x1.8 hole 1.1: 1(-6.35,0)
  round 1.8 hole 1.1: 2(-3.81,0) 3(-1.27,0) 4(1.27,0) 5(3.81,0) 6(6.35,0)
IND-SMD_L11.5-W10.0_SMMS1040
  rect 2.924x3.5 smd: 1(-5.181,0) 2(5.181,0)
LED0603-RD
  rect 0.8x0.8 smd: 1(-0.799,-0.004) 2(0.799,0.004)
LED0603-RD_RED
  rect 0.8x0.8 smd: 1(-0.799,-0.004) 2(0.799,0.004)
Pad_e2380
  round 0.61 smd: TP21(0,0)
Pad_e2384
  round 0.61 smd: TP22(0,0)
Pad_e2397
  round 0.61 smd: TP25(0,0)
Pad_e2429
  round 0.61 smd: TP28(0,0)
Pad_e2442
  round 0.61 smd: TP30(0,0)
Pad_e2445
  round 0.61 smd far side: TP32(0,0)
Pad_e2450
  round 4 hole 3: 27(0,0)
Pad_e2453
  round 4 hole 3: 27(0,0)
Pad_e2454
  round 4 hole 3: 27(0,0)
R0603
  rect 0.806x0.864 smd: 1(-0.753,0) 2(0.753,0)
R0805
  rect 1.133x1.377 smd: 1(-1,0) 2(1,0)
SENSOR-TH_DHT20
  round 1.524 hole 0.914: 1(-3.81,0) 2(-1.27,0) 3(1.27,0) 4(3.81,0)
SMA_L4.3-W2.6-LS5.2-RD
  rect 2x2 smd: 1(-2.2,0) 2(2.2,0)
SOT-23-3_L2.9-W1.6-P1.90-LS2.8-BR
  rect 1.07x0.6 smd: 1(1.235,-0.95) 2(1.235,0.95) 3(-1.235,0)
SOT-23-6_L2.9-W1.6-P0.95-LS2.8-BL
  rect 0.532x1.072 smd: 1(-0.95,-1.149) 2(0,-1.149) 3(0.95,-1.149) 4(0.95,1.149) 5(0,1.149) 6(-0.95,1.149)
SOT-89-3_L4.5-W2.5-P1.50-LS4.1-BR
  oval 1.9x0.7 smd: 1(1.25,-1.501) 3(1.25,1.501)
  oval 3.5x2 smd: 2(-1.25,0)
  oval 2.1x0.7 smd: 2(1.151,0)
SOT-223-3_L6.5-W3.4-P2.30-LS7.0-BR
  rect 2.5x1.1 smd: 1(2.97,-2.3) 2(2.97,0) 3(2.97,2.3)
  rect 2.34x3.6 smd: 4(-2.97,0)
SW-SMD_L3.9-W3.0-P4.45
  rect 1.23x1.36 smd: 1(-2.185,0) 2(2.185,0)
TSSOP-20_L6.5-W4.4-P0.65-LS6.4-BL
  oval 0.364x1.742 smd: 1(-2.925,-2.871) 2(-2.275,-2.871) 3(-1.625,-2.871) 4(-0.975,-2.871) 5(-0.325,-2.871) 6(0.325,-2.871) 7(0.975,-2.871) 8(1.625,-2.871) 9(2.275,-2.871) 10(2.925,-2.871) 11(2.925,2.871) 12(2.275,2.871) 13(1.625,2.871) 14(0.975,2.871) 15(0.325,2.871) 16(-0.325,2.871) 17(-0.975,2.871) 18(-1.625,2.871) 19(-2.275,2.871) 20(-2.925,2.871)
USB-C-SMD_TYPE-C-31-M-09
  oval 1.2x2.1 hole 0.8x1.7: 1(-4.325,1.732) 1(4.325,1.732)
  oval 1.2x1.8 hole 0.8x1.4: 1(-4.325,-2.448) 1(4.325,-2.448)
  rect 0.6x0.85 smd: A1B12(-3.2,2.447) A4B9(-2.4,2.447) B1A12(3.2,2.447) B4A9(2.4,2.448)
  rect 0.3x0.85 smd: A5(-1.25,2.447) A6(-0.25,2.447) A7(0.25,2.447) A8(1.25,2.447) B5(1.75,2.447) B6(0.75,2.447) B7(-0.75,2.447) B8(-1.75,2.447)
WIFIM-SMD_26P-L26.7-W13.0-P1.50
  rect 2x0.95 smd: 1(-6.4,9.002) 2(-6.4,7.501) 3(-6.4,6.002) 4(-6.4,4.501) 5(-6.4,3.002) 6(-6.4,1.501) 7(-6.4,0.002) 8(-6.4,-1.499) 9(-6.4,-2.998) 10(-6.4,-4.499) 11(-6.4,-5.998) 12(-6.4,-7.499) 13(-6.4,-8.999) 14(6.4,-9.001) 15(6.4,-7.501) 16(6.4,-6) 17(6.4,-4.5) 18(6.4,-2.999) 19(6.4,-1.499) 20(6.4,0.046) 21(6.4,1.501) 22(6.4,3.002) 23(6.4,4.501) 24(6.4,6.002) 25(6.4,7.501) 26(6.4,9.002)

## Nets
+3V3: BOOT.1 C1.1 C2.2 C11.2 C12.1 NOREF#4.TP22 NOREF#7.TP30 NOREF#9.TP28 U1.20 U2.2 U2.4 U5.4 U6.12 U7.1
+5V: C4.2 C6.2 D1.1 H1.2 H1.5 R1.1 U2.3
AGND: C1.2 C2.1 C3.1 C4.1 C5.1 C6.1 C7.2 C8.1 C9.2 C10.2 C11.1 C12.2 C13.2 CN1.2 NOREF.27 NOREF#3.27 NOREF#5.27 NOREF#6.TP32 NRST.1 Q2.3 Q3.3 R2.2 R4.1 R8.1 R9.2 R10.2 R12.1 R14.1 R20.2 R21.2 REST.2 U1.1 U2.1 U3.2 U4.1 U4.3 U4.9 U5.1 U6.13 U6.14 U7.3 USB1.1 USB1.A1B12 USB1.B1A12
VBAT+: C7.1 C13.1 CN1.1 D3.2 NOREF#8.TP25 Q1.3 R19.1 U4.5
VBUS: D2.2 R3.1 R4.2 R5.2 USB1.A4B9 USB1.B4A9
VIN: C3.2 C5.2 D2.1 D3.1 L1.1 NOREF#2.TP21 Q1.2 U3.4 U3.5
ADC: R19.2 R20.1 U6.10
BOOT: BOOT.2 C10.1 R10.1 U1.5
I2C1_SCL: U1.9 U7.4
I2C1_SDA: U1.8 U7.2
LED-STAT: STAT.2 U6.16
NRST: C9.1 NRST.2 R9.1 U1.10
P13-KEY: REST.1 U6.15
PWM1: H1.1 U1.15
PWM2: H1.4 U1.16
SERVO1-: H1.3 Q2.2
SERVO2-: H1.6 Q3.2
SERVOCTR1: R11.1 U1.7
SERVOCTR2: R13.1 U1.6
USART1_RX: U1.14 U5.3
USART1_TX: U1.13 U5.2
USART2_RX: U1.12 U6.1
USART2_TX: U1.11 U6.2
WAKEUP: U1.4 U6.19
$1N1635: D1.2 L1.2 U3.1
$1N1808: R1.2 R2.1 U3.3
$1N2553: Q1.1 R3.2
$1N3521: G充满了.1 R6.2
$1N3547: R7.2 R充电中.1
$1N3574: R6.1 U4.6
$1N3588: R7.1 U4.7
$1N3600: C8.2 G充满了.2 R5.1 R充电中.2 U4.4 U4.8
$1N3631: R8.2 U4.2
$1N5712: Q2.1 R11.2 R12.2
$1N5900: Q3.1 R13.2 R14.2
$1N6798: R21.1 STAT.1

Pads without a net: U1 2 3 17 18 19; U3 6; U6 3 4 5 6 7 8 9 11 17 18 20 21 22 23 24 25 26; USB1 A5 A6 A7 A8 B5 B6 B7 B8

## Via types
v1: diameter 0.61, hole 0.304, Top Layer to Bottom Layer, 69 vias
v2: diameter 0.61, hole 0.305, Top Layer to Bottom Layer, 23 vias
v3: diameter 0.71, hole 0.405, Top Layer to Bottom Layer, 2 vias

## Routing (per net, layer and track width the routed paths; a pad name or vN(x,y) marks a point on that pad's centre or on a via; arc(x,y) is an arc through that point)
+3V3: length 91.2
  Top Layer w0.5: 40.45,37.04 40.68,36.81 U5.4 ; U2.2 U2.4 ; 35.91,37.97 33.63,35.69 U1.20 ; 35.91,37.97 35.53,38.35 BOOT.1 ; 35.91,37.97 35.91,39.85
  Top Layer w1: U7.1 45.59,51.18 41.15,51.18 40.45,50.48 40.45,36.36 39.09,35.01 37.26,35.01 35.91,36.35 35.91,37.97 ; 40.68,36.81 40.68,36.79 v2(42.93,34.54) ; 35.91,39.85 35.91,49.97 U2.4 ; U6.12 31.87,17.68 31.14,18.42 NOREF#9.TP28 28.43,18.42 C12.1 C11.2 28.7,20.19 v3(29.21,20.7)
  Bottom Layer w1: v3(29.21,20.7) 30.1,20.7 42.93,33.53 v2(42.93,34.54)
+5V: length 68
  Top Layer w0.5: 2.41,28.96 3.68,28.96 H1.2 ; R1.1 12,42.48 ; 7.35,43.03 C4.2 C6.2 7.59,45.7 D1.1
  Top Layer w1: 30.43,48.25 30.43,42.62 28.07,40.26 26.29,40.26 24.89,38.86 12.7,38.86 12,39.56 12,42.48 11.05,41.53 8.48,41.53 7.35,42.65 7.35,43.03 2.41,38.09 2.41,21.59 2.54,21.46 3.81,21.46 H1.5
AGND: length 135.1
  Top Layer w0.5: 36.93,77.2 36.93,76.98 ; 36.93,77.2 40.7,77.2 v1(40.93,76.96) ; 36.93,77.2 USB1.1 USB1.1 28.28,77.09 ; 36.93,76.98 USB1.1 ; 36.93,76.98 36.91,76.96 v1(35.85,76.96) ; v1(30.77,5.84) 31.87,4.75 31.87,3.63 ; U1.1 27.05,36.25 v1(27.05,36.96) 25.41,35.31 R10.2 ; v2(38.35,41.15) 38.1,40.89 38.1,40.64 C2.1 C1.2 ; 7.64,36.32 Q2.3 ; 7.64,36.32 v1(5.37,36.32) ; 7.64,36.32 8,36.32 R12.1 ; v1(40.93,21.08) 38.77,18.92 R20.2 ; R4.1 35.56,66.42 35.56,65.92 35.53,65.95 C7.2 ; REST.2 20.74,10.15 20.45,10.15 ; 27.3,16 26.77,16.54 C12.2 C11.1 26.58,20.19 v1(25.69,21.08) ; 27.3,16 27.43,15.88 29.81,15.88 U6.13 ; 27.3,16 v1(25.69,16) ; 35.8,74.52 36.21,74.52 USB1.1 ; 20.45,10.15 v2(20.45,10.57) ; 20.45,10.15 R21.2 ; v1(25.69,26.16) 27.52,26.16 C9.2 ; 30.48,55.36 30.77,55.66 v1(30.77,56.64) ; 30.48,55.36 30.48,52.78 U2.1 ; 30.48,55.36 30.48,55.76 ; U4.9 33.3,61.47 33.94,62.1 U4.3 37.45,62.1 C8.1 40.78,62.09 41.4,61.47 41.4,60.91 R8.1 41.66,60.25 v2(41.66,59.31) 41.4,59.56 U4.1 ; v1(20.61,41.4) 19.6,40.39 18.95,40.39 ; CN1.2 10.16,75.5 10.16,76.08 ; NRST.1 34.36,22.58 v1(35.85,21.08) ; v1(25.69,76.96) 28.15,76.96 28.28,77.09 ; C13.2 29.4,72.26 USB1.B1A12 28.69,75.23 USB1.1 28.28,77.09 ; USB1.1 37.26,75.23 38.99,76.96 ; v2(44.45,29.59) 46.84,29.59 U5.1 ; R14.1 18.55,34.67 v1(16.13,34.67) 16.13,31.83 15.7,31.4 ; R9.2 40.27,26.83 v1(40.93,26.16) ; 25.66,43.12 C3.1 ; 25.66,43.12 25.69,43.08 v1(25.69,41.4) ; 25.66,43.12 C5.1 ; C10.2 21.27,37.72 v2(20.07,37.72) ; C4.1 C6.1 9.44,45.47 v1(10.45,46.48) ; v2(15.62,43.94) U3.2
  vias: v1(5.37,76.96) v1(5.37,71.88) v1(5.37,66.8) v1(5.37,61.72) v1(5.37,56.64) v1(5.37,51.56) v1(5.37,46.48) v1(5.37,16) v1(5.37,10.92) v1(5.37,5.84) v1(10.45,76.96) v1(10.45,71.88) v1(10.45,66.8) v1(10.45,61.72) v1(10.45,56.64) v1(10.45,26.16) v1(10.45,16) v1(10.45,10.92) v1(10.45,5.84) v1(15.53,76.96) v1(15.53,71.88) v1(15.53,56.64) v1(15.53,51.56) v1(15.53,21.08) v1(15.53,16) v1(15.53,10.92) v1(20.61,76.96) v1(20.61,71.88) v1(20.61,61.72) v1(20.61,56.64) v1(20.61,46.48) v1(20.61,31.24) v1(20.61,26.16) v1(20.61,16) v1(20.61,5.84) v1(25.69,56.64) v1(25.69,51.56) v1(25.69,10.92) v1(25.69,5.84) v1(30.77,76.96) v1(30.77,51.56) v1(30.77,41.4) v1(30.77,10.92) v1(35.85,66.8) v1(35.85,61.72) v1(35.85,56.64) v1(35.85,10.92) v1(35.85,5.84) v1(40.93,61.72) v1(40.93,56.64) v1(40.93,10.92) v1(40.93,5.84) v3(31.88,62.07)
VBAT+: length 131.6
  Top Layer w0.5: C7.1 31.15,69.92 Q1.3 31.86,72.01 C13.1
  Top Layer w1: v2(28.45,23.88) 32.71,19.62 R19.1 ; U4.5 28.97,63.77 C7.1 30.98,65.95 26.42,70.51 26.42,72.5 25,73.91 CN1.1 1.14,60.81 1.14,17.91 2.03,17.02 16.51,17.02 v2(22.73,23.24)
  Bottom Layer w1: v2(28.45,23.88) 23.37,23.88 v2(22.73,23.24)
VBUS: length 37.8
  Top Layer w0.5: R4.2 38.89,68.24 R3.1 ; 35,75.01 35,74.52 34.9,74.42 34.9,73.68 35.18,73.41 30.23,73.41 30.23,74.49 USB1.B4A9 ; 44.01,67.51 D2.2
  Top Layer w1: 35.18,73.41 46.94,73.41 46.94,70.44 D2.2 ; R4.2 39.16,67.52 44.01,67.52 44.01,67.51 43.43,66.92 R5.2
VIN: length 85.2
  Top Layer w0.5: C3.2 25.66,44.52 C5.2 21.78,44.52 21.21,43.94 20.48,43.94 ; U3.5 20.48,43.94 ; 20.48,43.94 19.53,42.99 U3.4 ; 25.6,66.93 D3.1
  Top Layer w1: v2(21.46,69.6) 22.93,69.6 25.6,66.93 12.19,66.93 12.19,57.4 18.8,50.8 21.31,50.8 L1.1 25.75,48.13 C3.2 ; Q1.2 35.15,72.14 v2(38.33,72.14) 39.75,72.14 42,69.89
  Bottom Layer w1: v2(38.33,72.14) 35.79,69.6 v2(21.46,69.6)
ADC: length 5.7
  Top Layer w0.5: U6.10 34.87,18.39 R19.2 36.84,19.05 R20.1
BOOT: length 13.2
  Top Layer w0.5: 23.33,37.15 25.4,37.15 25.4,37.35 26.02,37.97 26.82,37.97 27.12,38.35 BOOT.2 ; C10.1 23.37,37.03 23.37,34.95 25.2,33.09 U1.5
I2C1_SCL: length 27.5
  Top Layer w0.5: v2(30.86,30.1) 29.12,30.1 28.73,30.49 U1.9 ; U7.4 43.3,43.3 v2(42.42,42.42)
  Bottom Layer w0.5: v2(30.86,30.1) 31.88,29.08 33.78,29.08 42.42,37.72 v2(42.42,42.42)
I2C1_SDA: length 30.3
  Top Layer w0.5: v2(30.86,30.86) 30.58,31.14 U1.8 ; U7.2 45.73,48.26 v2(42.42,48.26)
  Bottom Layer w0.5: v2(30.86,30.86) 33.02,30.86 35.94,33.78 35.94,41.78 v2(42.42,48.26)
LED-STAT: length 20.9
  Top Layer w0.5: U6.16 33.53,3.47 33.53,1.78 17.3,1.78 STAT.2
NRST: length 11.3
  Top Layer w0.5: U1.10 29.57,27.88 C9.1 33.32,26.81 NRST.2 36.84,26.95 R9.1
P13-KEY: length 9.1
  Top Layer w0.5: 26.34,3.63 30.37,3.63 ; 26.34,3.63 26.19,3.63 ; 26.34,3.63 25.3,4.67 REST.1
PWM1: length 34.9
  Top Layer w0.5: v2(31.62,32) 32.06,32.44 U1.15 ; H1.1 6.6,32.13 v2(6.73,32)
  Bottom Layer w0.5: v2(6.73,32) 10.16,28.58 24.26,28.58 30.23,34.54 31.62,33.15 v2(31.62,32)
PWM2: length 32.7
  Top Layer w0.5: v2(29.97,33.15) 33.3,33.15 U1.16 ; v2(6.86,24.38) 6.73,24.51 H1.4
  Bottom Layer w0.5: v2(29.97,33.15) 21.21,24.38 v2(6.86,24.38)
SERVO1-: length 10.6
  Top Layer w1: H1.3 8.76,27.05 10.52,28.81 Q2.2
SERVO2-: length 17.7
  Top Layer w1: H1.6 9.27,19.43 17.2,27.36 Q3.2
SERVOCTR1: length 15.1
  Top Layer w0.5: U1.7 v2(23.86,31.79) ; v2(16.76,37.08) 16.51,37.34 R11.1
  Bottom Layer w0.5: v2(16.76,37.08) 18.57,37.08 v2(23.86,31.79)
SERVOCTR2: length 7.9
  Top Layer w0.5: R13.1 22.73,34.79 22.73,33.4 23.49,32.64 24.64,32.64 24.83,32.44 U1.6
USART1_RX: length 14.9
  Top Layer w0.5: U5.3 45.74,32.77 35.69,32.77 34.71,31.79 U1.14
USART1_TX: length 14.1
  Top Layer w0.5: U5.2 46.66,31.14 U1.13
USART2_RX: length 24.8
  Top Layer w0.4: U6.1 48.37,23.26 41.14,30.49 U1.12
USART2_TX: length 24.9
  Top Layer w0.4: U1.11 40.52,29.84 47.43,22.92 45.85,21.34 45.85,20.44 46.87,19.42 46.87,18.88 46.36,18.37 46.36,17.64 46.87,17.13 U6.2
WAKEUP: length 41.9
  Top Layer w0.5: v2(24.64,30.73) 24.64,12.32 25.15,11.81 31.75,11.81 37.97,5.59 37.97,3.74 U6.19 ; v2(26.16,33.91) 26.26,33.81 27.54,33.81 U1.4
  Bottom Layer w0.5: v2(24.64,30.73) 26.16,32.26 v2(26.16,33.91)
$1N1635: length 13.6
  Top Layer w0.5: L1.2 10.78,52.75 D1.2
  Top Layer w1: U3.1 11.84,50.07 L1.2
$1N1808: length 6.2
  Top Layer w0.5: U3.3 16.53,42.51 14.82,42.51 ; R1.2 14.82,42.51 ; 14.82,42.51 16.95,40.39
$1N2553: length 2.4
  Top Layer w0.5: Q1.1 35.05,70.33 R3.2
$1N3521: length 2.5
  Top Layer w0.5: G充满了.1 15.4,60.44 R6.2
$1N3547: length 2.5
  Top Layer w0.5: R充电中.1 19.44,60.5 R7.2
$1N3574: length 15.7
  Top Layer w0.5: U4.6 26.67,62.1 22.99,65.79 16.79,65.79 R6.1
$1N3588: length 11.1
  Top Layer w0.5: U4.7 25.78,60.83 22.1,64.52 19.44,64.52 19.44,64.51
$1N3600: length 46.9
  Top Layer w0.5: U4.8 28.3,58.89 26.98,58.89 ; G充满了.2 19.35,58.81 R充电中.2 26.98,58.89 ; 40.11,64.66 38.64,64.66 C8.2 34.9,63.49 U4.4 ; 40.11,64.66 43.05,61.72 43.05,57.66 27.3,57.66 26.98,57.98 26.98,58.89 ; 40.11,64.66 R5.1
$1N3631: length 5
  Top Layer w0.5: R8.2 39.56,60.83 U4.2
$1N5712: length 6
  Top Layer w0.5: R12.2 12.02,35.84 Q2.1 13.34,36.26 R11.2
$1N5900: length 5.4
  Top Layer w0.5: R13.2 19.58,31.4 18.7,31.4 18.67,31.43 R14.2
$1N6798: length 3.3
  Top Layer w0.5: R21.1 15.37,5.32 STAT.1

## Copper pours and planes (outline as drawn; the poured copper is in the pictures)
+3V3 on Top Layer: 36.54,36.82 45.74,36.82 45.75,36.81 45.74,36.8 45.74,34.06 36.81,34.06 35.69,35.18 35.69,36.61 35.94,36.87 36.49,36.87
+3V3 on Top Layer: 31.5,53.75 42.93,53.75 42.93,43.82 31.5,43.82
AGND on Bottom Layer: 0.29,80.35 46.1,80.35 46.1,0.76 0.29,0.76
VBAT+ on Top Layer: 10.57,69.6 19.05,69.6 22.73,73.28 23.17,73.28 23.81,73.91 14.24,73.91 10.57,70.24
VBAT+ on Top Layer: 1.14,40.58 4.19,43.63 4.19,61.21 12.57,69.6 12.57,69.85 12.6,69.88 1.24,69.88 0.29,68.93 0.29,16.6 2.16,14.73 17.4,14.73 22.99,20.32 23.37,24.1 21.84,24.1 15.88,23.5 10.41,18.03 2.26,18.03 1.14,19.15
VIN on Top Layer: 18.06,45.18 21.59,45.18 21.59,42.67 18.06,42.67
VIN on Top Layer: 13.84,67.31 11.43,67.31 10.03,65.91 10.03,57.91 9.91,57.79 17.27,50.42 17.53,50.42 17.53,53.47 12.7,58.29 12.7,65.66 13.72,66.68 13.22,67.17 13.7,67.17
$1N1808 on Top Layer: 13.41,43.42 17.44,43.42 17.44,39.6 13.41,39.6

Small or netless copper shapes (teardrops, artwork), in the pictures only: 2 on Bottom Layer

## Text on the board
Bottom Silkscreen Layer: by Jake W
Top Silkscreen Layer: 电池测试点 | 输出测试点 | 滤波前3v3测试点 | 滤波后3v3测试点 | 供电测试点
